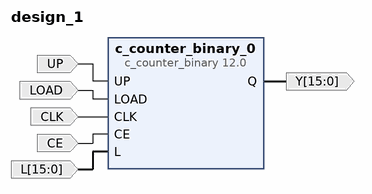
[diagram p0: block diagram of the top level]
# Vivado block design design_1, xc7a200tfbg676-2, Vivado 2020.2
create_bd_design design_1

create_bd_port -dir I -type data UP
create_bd_port -dir I -type data LOAD
create_bd_port -dir I -type clk CLK
set_property -dict {CONFIG.FREQ_HZ 10000000} [get_bd_ports CLK]
create_bd_port -dir I -type ce CE
set_property -dict {CONFIG.POLARITY ACTIVE_HIGH} [get_bd_ports CE]
create_bd_port -dir I -from 15 -to 0 -type data L
create_bd_port -dir O -from 15 -to 0 -type data Y

create_bd_cell -type ip -vlnv xilinx.com:ip:c_counter_binary:12.0 c_counter_binary_0
set_property -dict [list \
  CONFIG.CE true \
  CONFIG.Count_Mode UPDOWN \
  CONFIG.Implementation Fabric \
  CONFIG.Load true \
  CONFIG.Restrict_Count false \
  CONFIG.SCLR false \
  CONFIG.SSET false \
] [get_bd_cells c_counter_binary_0]

# ---- connections ----

connect_bd_net -net UP_0_1 [get_bd_ports UP] [get_bd_pins c_counter_binary_0/UP]
connect_bd_net -net LOAD_0_1 [get_bd_ports LOAD] [get_bd_pins c_counter_binary_0/LOAD]
connect_bd_net -net CLK_0_1 [get_bd_ports CLK] [get_bd_pins c_counter_binary_0/CLK]
connect_bd_net -net CE_0_1 [get_bd_ports CE] [get_bd_pins c_counter_binary_0/CE]
connect_bd_net -net L_0_1 [get_bd_ports L] [get_bd_pins c_counter_binary_0/L]
connect_bd_net [get_bd_pins c_counter_binary_0/Q] [get_bd_ports Y]

validate_bd_design
save_bd_design
